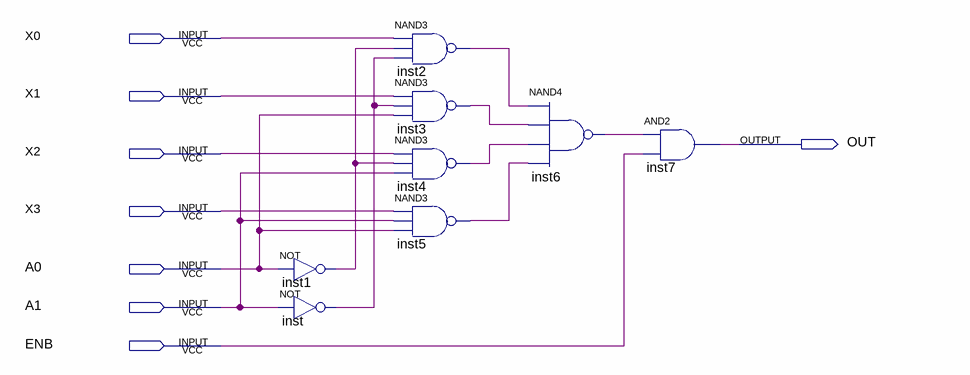
[diagram p0: schematic sheet]
// Quartus schematic MUX4x1_sch.bdf as structural Verilog: 8 symbols, 8 pins
module MUX4x1_sch (
  input  X0,
  input  X1,
  input  X2,
  input  X3,
  input  A0,
  input  A1,
  input  ENB,
  output OUT
);

  wire inst1_out, inst2_out, inst3_out, inst4_out, inst5_out, inst6_out, inst_out;

  not inst1 (inst1_out, A0);
  not inst (inst_out, A1);
  nand inst2 (inst2_out, X0, inst1_out, inst_out);
  nand inst3 (inst3_out, X1, inst_out, A0);
  nand inst4 (inst4_out, X2, inst1_out, A1);
  nand inst5 (inst5_out, X3, A1, A0);
  nand inst6 (inst6_out, inst2_out, inst3_out, inst4_out, inst5_out);
  and inst7 (OUT, inst6_out, ENB);
endmodule
